# Altium project x-IMU3-Thermometer.PrjPcb
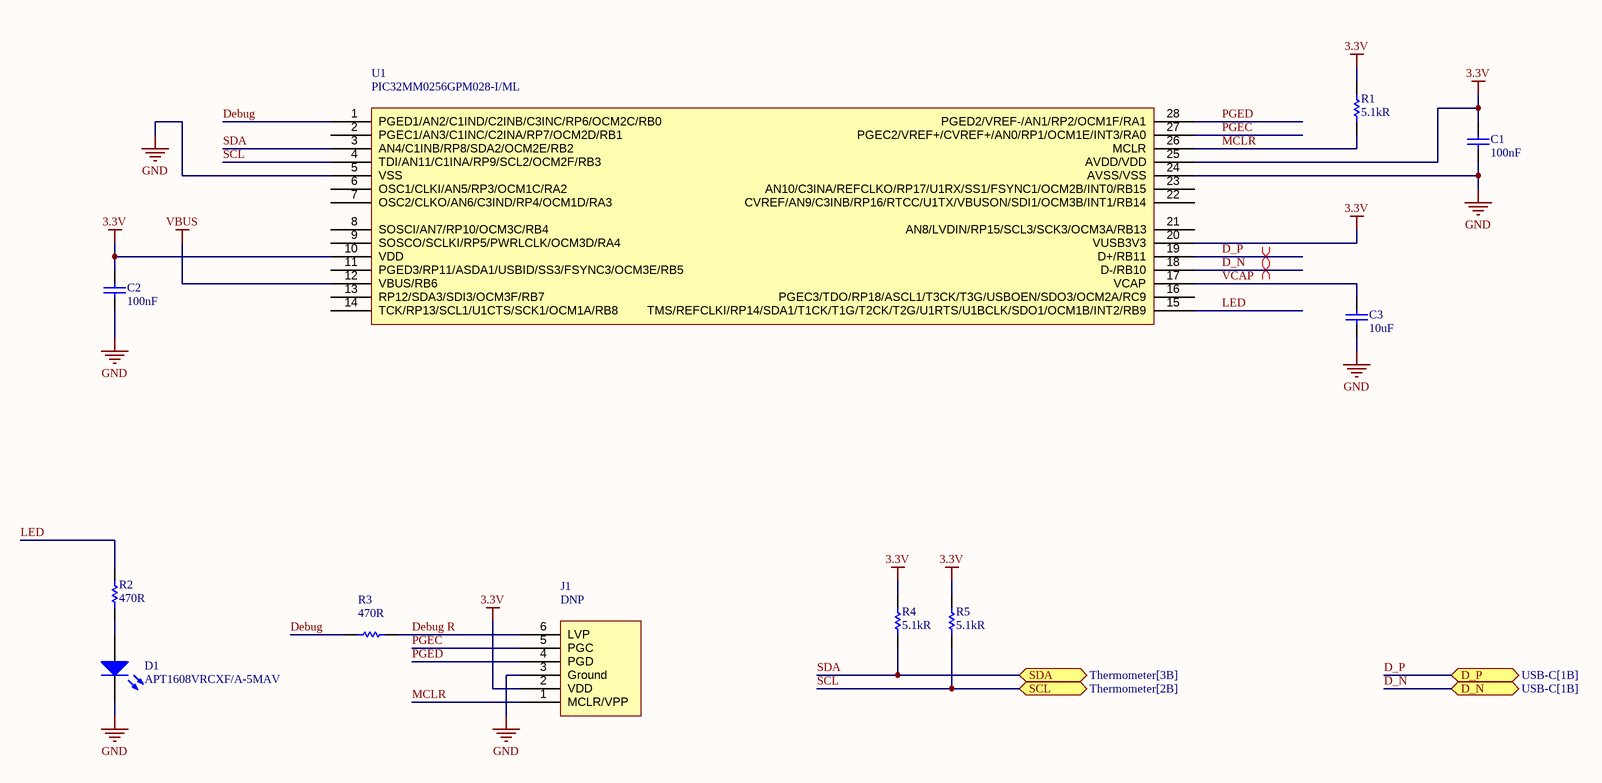
[diagram p0: PIC32MM.SchDoc]
Version: v1.2; Project: x-IMU3 Thermometer; Author: Seb Madgwick
4 sheets, 22 parts. Net scope: flat (ports and power ports of the same name join across sheets).
Board file: x-IMU3 Thermometer.PcbDoc
Sheets:
  PIC32MM.SchDoc
  USB-C.SchDoc
  3.3V Regulator.SchDoc
  Thermometer.SchDoc

## Sheet PIC32MM.SchDoc
size A3; SheetNumber: 1; SheetTotal: 4

### Parts
C1  100nF  [Capacitor 0402]
C2  100nF  [Capacitor 0402]
C3  10uF  [Capacitor 0402]
D1  APT1608VRCXF/A-5MAV  [LED 0603]
J1  DNP  [Tag Connect No Legs]
R1  5.1kR  [Resistor 0402]
R2  470R  [Resistor 0402]
R3  470R  [Resistor 0402]
R4  5.1kR  [Resistor 0402]
R5  5.1kR  [Resistor 0402]
U1  PIC32MM0256GPM028-I/ML  [QFN-28]

### Ports
D_N (bidir, see USB-C[1B]), D_P (bidir, see USB-C[1B]), SCL (bidir, see Thermometer[2B]), SDA (bidir, see Thermometer[3B])

### Nets
3.3V: C1.2 C2.2 J1.2(VDD) R1.2 R4.2 R5.2 U1.10(VDD) U1.20(VUSB3V3) U1.25(AVDD/VDD)
GND: C1.1 C2.1 C3.1 D1.K J1.3(Ground) U1.5(VSS) U1.24(AVSS/VSS)
VBUS: U1.12(VBUS/RB6)
D_N: U1.18(D-/RB10) ; port D_N
D_P: U1.19(D+/RB11) ; port D_P
Debug: R3.2 U1.1(PGED1/AN2/C1IND/C2INB/C3INC/RP6/OCM2C/RB0)
Debug R: J1.6(LVP) R3.1
LED: R2.2 U1.15(TMS/REFCLKI/RP14/SDA1/T1CK/T1G/T2CK/T2G/U1RTS/U1BCLK/SDO1/OCM1B/INT2/RB9)
MCLR: J1.1(MCLR/VPP) R1.1 U1.26(MCLR)
PGEC: J1.5(PGC) U1.27(PGEC2/VREF+/CVREF+/AN0/RP1/OCM1E/INT3/RA0)
PGED: J1.4(PGD) U1.28(PGED2/VREF-/AN1/RP2/OCM1F/RA1)
SCL: R5.1 U1.4(TDI/AN11/C1INA/RP9/SCL2/OCM2F/RB3) ; port SCL
SDA: R4.1 U1.3(AN4/C1INB/RP8/SDA2/OCM2E/RB2) ; port SDA
VCAP: C3.2 U1.17(VCAP)
NetD1_A: D1.A R2.1

Not connected (* = marked no-connect by the designer): U1 2(PGEC1/AN3/C1INC/C2INA/RP7/OCM2D/RB1) 6(OSC1/CLKI/AN5/RP3/OCM1C/RA2) 7(OSC2/CLKO/AN6/C3IND/RP4/OCM1D/RA3) 8(SOSCI/AN7/RP10/OCM3C/RB4) 9(SOSCO/SCLKI/RP5/PWRLCLK/OCM3D/RA4) 11(PGED3/RP11/ASDA1/USBID/SS3/FSYNC3/OCM3E/RB5) 13(RP12/SDA3/SDI3/OCM3F/RB7) 14(TCK/RP13/SCL1/U1CTS/SCK1/OCM1A/RB8) 16(PGEC3/TDO/RP18/ASCL1/T3CK/T3G/USBOEN/SDO3/OCM2A/RC9) 21(AN8/LVDIN/RP15/SCL3/SCK3/OCM3A/RB13) 22(CVREF/AN9/C3INB/RP16/RTCC/U1TX/VBUSON/SDI1/OCM3B/INT1/RB14) 23(AN10/C3INA/REFCLKO/RP17/U1RX/SS1/FSYNC1/OCM2B/INT0/RB15)

### Layout directives
differential pair: D_N, D_P

### Notes on the sheet
- TITLE
- SIZE
- A3
- VARIANT
- PROJECT
- SHEET
- VERSION
- OF
- AUTHOR
- DATE

### Library data of the parts
C1-C3 = Capacitor
D1 = LED
J1 = MPLAB ICSP
R1-R5 = Resistor

## Sheet USB-C.SchDoc
size A4; SheetNumber: 2; SheetTotal: 4
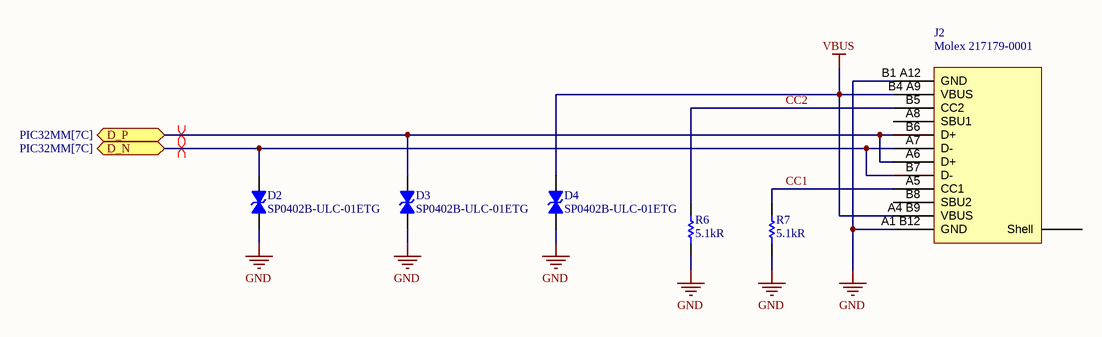
[diagram p1: USB-C.SchDoc]

### Parts
D2  SP0402B-ULC-01ETG  [Diode TVS 0402]
D3  SP0402B-ULC-01ETG  [Diode TVS 0402]
D4  SP0402B-ULC-01ETG  [Diode TVS 0402]
J2  Molex 217179-0001  [Molex 217179-0001]
R6  5.1kR  [Resistor 0402]
R7  5.1kR  [Resistor 0402]

### Ports
D_N (bidir, see PIC32MM[7C]), D_P (bidir, see PIC32MM[7C])

### Nets
GND: D2.2 D3.2 D4.2 J2.A1_B12(GND) J2.B1_A12(GND) R6.1 R7.1
VBUS: D4.1 J2.A4_B9(VBUS) J2.B4_A9(VBUS)
CC1: J2.A5(CC1) R7.2
CC2: J2.B5(CC2) R6.2
D_N: D2.1 J2.A7(D-) J2.B7(D-) ; port D_N
D_P: D3.1 J2.A6(D+) J2.B6(D+) ; port D_P

Not connected (* = marked no-connect by the designer): J2 A8(SBU1) B8(SBU2) Shell

### Layout directives
differential pair: D_N, D_P

### Notes on the sheet
- TITLE
- SIZE
- A4
- VARIANT
- PROJECT
- SHEET
- VERSION
- OF
- AUTHOR
- DATE

### Library data of the parts
D2-D4 = Diode TVS
J2 = USB-C Receptacle (16 Pin)
R6 R7 = Resistor

## Sheet 3.3V Regulator.SchDoc
size A4; SheetNumber: 3; SheetTotal: 4
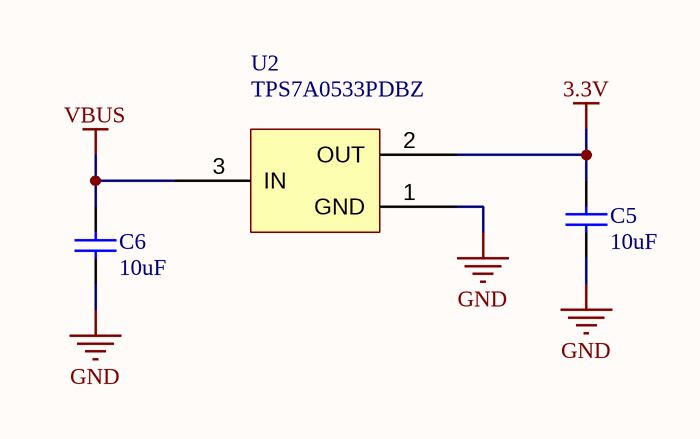
[diagram p2: 3.3V Regulator.SchDoc]

### Parts
(Parts that share a designator on the sheet are numbered #1, #2 ... from top to bottom, then left to right.)
C5  10uF  [Capacitor 0402]
C6#1  10uF  [Capacitor 0402]
U2  TPS7A0533PDBZ  [SOT-23]

### Nets
3.3V: C5.2 U2.2(OUT)
GND: C5.1 C6#1.1 U2.1(GND)
VBUS: C6#1.2 U2.3(IN)

### Notes on the sheet
- TITLE
- SIZE
- A4
- VARIANT
- PROJECT
- SHEET
- VERSION
- OF
- AUTHOR
- DATE

### Library data of the parts
C5 C6#1 = Capacitor

## Sheet Thermometer.SchDoc
size A4; SheetNumber: 4; SheetTotal: 4
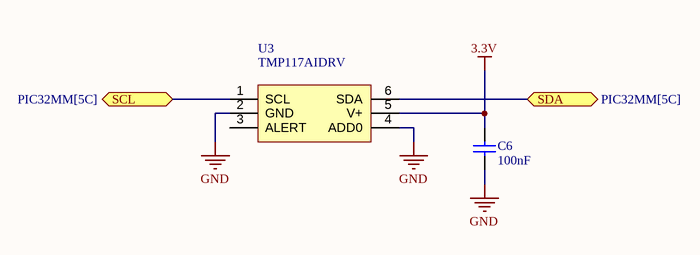
[diagram p3: Thermometer.SchDoc]

### Parts
(Parts that share a designator on the sheet are numbered #1, #2 ... from top to bottom, then left to right.)
C6#2  100nF  [Capacitor 0402]
U3  TMP117AIDRV  [WSON-6]

### Ports
SCL (bidir, see PIC32MM[5C]), SDA (bidir, see PIC32MM[5C])

### Nets
3.3V: C6#2.2 U3.5(V+)
GND: C6#2.1 U3.2(GND) U3.4(ADD0)
SCL: U3.1(SCL) ; port SCL
SDA: U3.6(SDA) ; port SDA

Not connected (* = marked no-connect by the designer): U3 3(ALERT)

### Notes on the sheet
- TITLE
- SIZE
- A4
- VARIANT
- PROJECT
- SHEET
- VERSION
- OF
- AUTHOR
- DATE

### Library data of the parts
C6#2 = Capacitor

## Nets that join several sheets
3.3V: PIC32MM (9 pins), 3.3V Regulator (C5.2 U2.2), Thermometer (C6#2.2 U3.5)
GND: PIC32MM (7 pins), USB-C (7 pins), 3.3V Regulator (C5.1 C6#1.1 U2.1), Thermometer (C6#2.1 U3.2 U3.4)
VBUS: PIC32MM (U1.12), USB-C (D4.1 J2.A4 B9 J2.B4 A9), 3.3V Regulator (C6#1.2 U2.3)
D_N: PIC32MM (U1.18), USB-C (D2.1 J2.A7 J2.B7)
D_P: PIC32MM (U1.19), USB-C (D3.1 J2.A6 J2.B6)
SCL: PIC32MM (R5.1 U1.4), Thermometer (U3.1)
SDA: PIC32MM (R4.1 U1.3), Thermometer (U3.6)